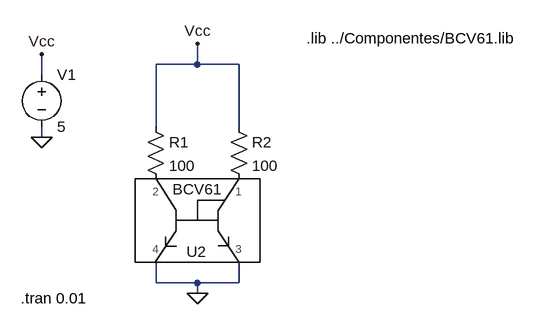
[diagram p0: schematic Drenador.asc]
Drenador.asc, the LTspice schematic file:
Version 4
SHEET 1 1180 680
WIRE 672 -240 672 -272
WIRE 672 -240 608 -240
WIRE 736 -240 672 -240
WIRE 432 -224 432 -256
WIRE 608 -144 608 -240
WIRE 736 -144 736 -240
WIRE 432 -128 432 -144
WIRE 608 96 608 64
WIRE 672 96 608 96
WIRE 736 96 736 64
WIRE 736 96 672 96
WIRE 672 112 672 96
FLAG 432 -128 0
FLAG 432 -256 Vcc
FLAG 672 -272 Vcc
FLAG 672 112 0
SYMBOL res 592 -160 R0
SYMATTR InstName R1
SYMATTR Value 100
SYMBOL res 720 -160 R0
SYMATTR InstName R2
SYMATTR Value 100
SYMBOL voltage 432 -240 R0
WINDOW 123 0 0 Left 2
WINDOW 39 0 0 Left 2
SYMATTR InstName V1
SYMATTR Value 5
SYMBOL BCV61 672 0 R180
SYMATTR InstName U2
TEXT 840 -280 Left 2 !.lib ../Componentes/BCV61.lib
TEXT 400 120 Left 2 !.tran 0.01

The netlist it stands for:
* Drenador.asc
R1 Vcc P001 100
R2 Vcc P002 100
V1 Vcc 0 5
XU2 P002 P001 0 0 BCV61  ; pins 1 2 3 4
.lib ../Componentes/BCV61.lib
.tran 0.01
.backanno
.end